# Altium project MB1829.PrjPcb (part 1 of 5)
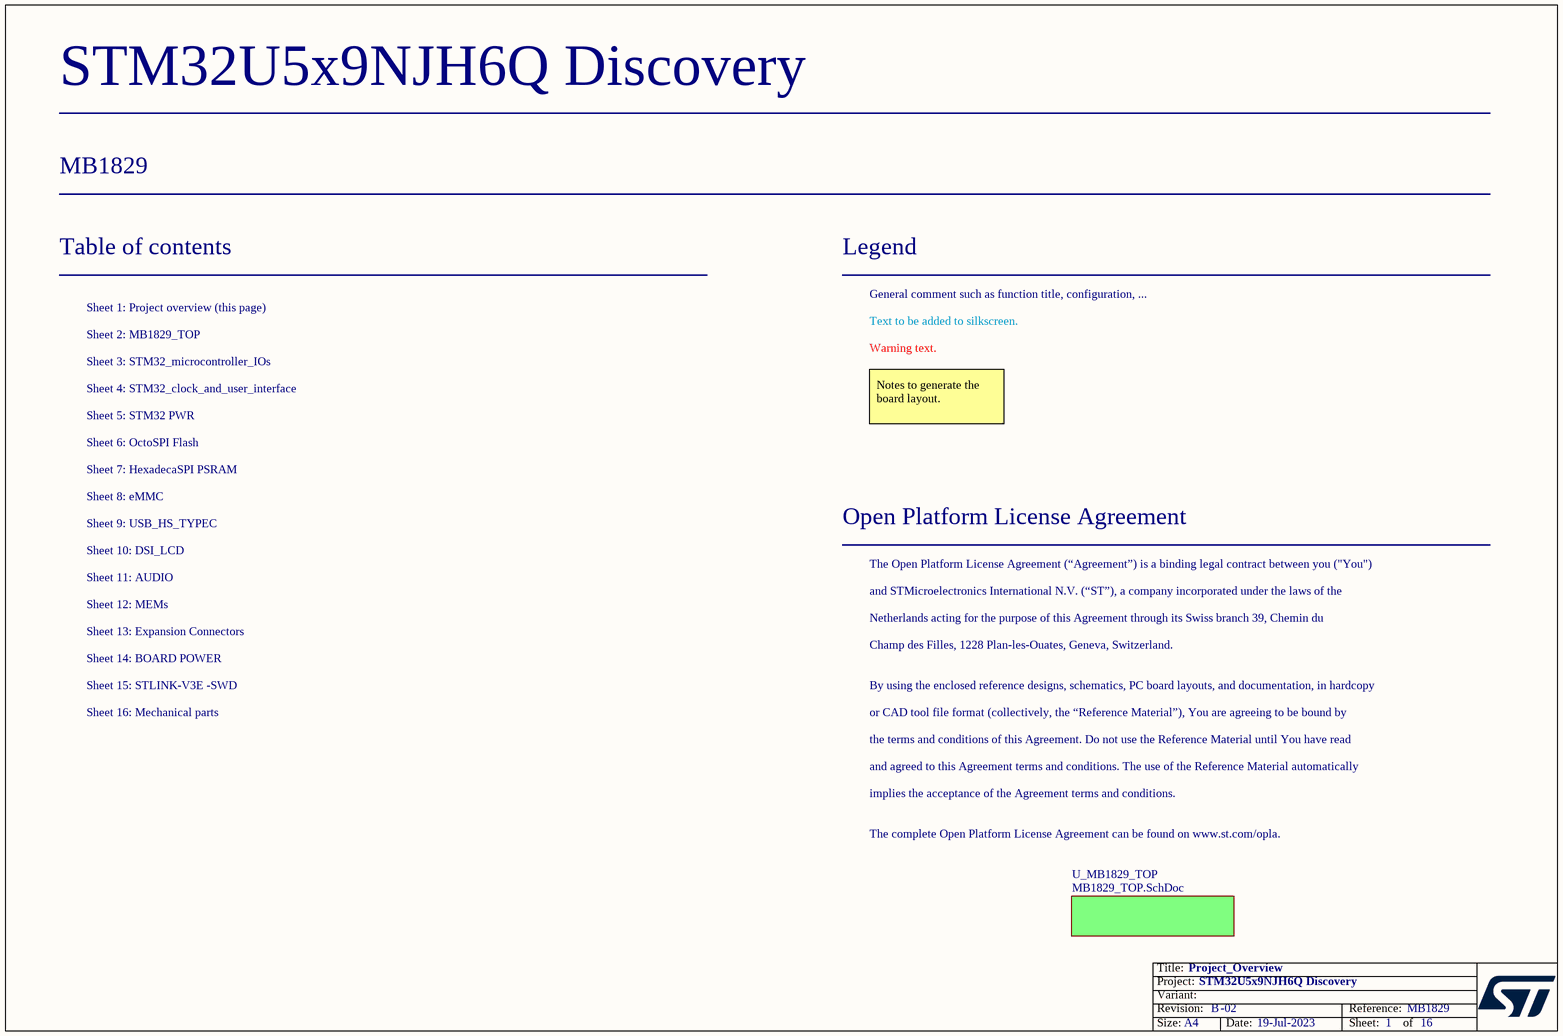
[diagram p0: Project_Overview.SchDoc]
Board_Assembly_Revision: 02; Board_Document_Date: 19-Jul-2023; Board_Name: STM32U5x9NJH6Q Discovery; Board_PCB_Revision: B; Board_Reference: MB1829
16 sheets, 473 parts. Net scope: flat (ports and power ports of the same name join across sheets).
Board file: MB1829.PcbDoc
Sheets:
  Project_Overview.SchDoc
    U_MB1829_TOP = MB1829_TOP.SchDoc
      U_EXPANSION_CONNECTORS = EXPANSION_CONNECTORS.SchDoc
      U_AUDIO = AUDIO.SchDoc
      U_BOARD_POWER = BOARD_POWER.SchDoc
      U_MCU_CLOCK_AND_USER_INTERFACE = MCU_CLOCK_AND_USER_INTERFACE.SchDoc
      U_MCU_IO = MCU_IO.SchDoc
      U_MCU_PWR = MCU_PWR.SchDoc
      U_MECHANICAL = MECHANICAL.SchDoc
      U_OCTOSPI_FLASH = OCTOSPI_FLASH.SchDoc
      U_ST_LINK_V3E = ST_LINK_V3E.SchDoc
      U_USBHS_TYPEC = USBHS_TYPEC.SchDoc
      U_eMMC = eMMC.SchDoc
      U_HEXADECASPI_PSRAM = HEXADECASPI_PSRAM.SchDoc
      U_DSI_LCD = DSI_LCD.SchDoc
      U_MEMS = MEMS.SchDoc

## Sheet Project_Overview.SchDoc: Project_Overview
size A4; Date: Not used; ApprovedBy: Not used; CheckedBy: Not used; Author: Not used; CompanyName: STMicroelectronics; DrawnBy: Not used; Engineer: Not used; Organization: Not used; Address1: Not used; Address2: Not used; Address3: Not used; Address4: Not used; DocumentNumber: Not used; Revision: Not used; SheetNumber: 1; SheetTotal: 16; CurrentTime: Not used; CurrentDate: Not used; Time: Not used; DocumentFullPathAndName: Not used; DocumentName: Not used; ModifiedDate: Not used; ImagePath: Not used; ProjectName: Not used; Application_BuildNumber: Not used

### Sub-sheets
U_MB1829_TOP = MB1829_TOP.SchDoc: no entries

### Notes on the sheet
- Table of contents
- Sheet 1: Project overview (this page)
- Legend
- General comment such as function title, configuration, ...
- Sheet 2: MB1829_TOP
- Sheet 3: STM32_microcontroller_IOs
- Text to be added to silkscreen.
- Warning text.
- Sheet 4: STM32_clock_and_user_interface
- Sheet 6: OctoSPI Flash
- Sheet 5: STM32 PWR
- Notes to generate the board layout.
- Sheet 8: eMMC
- Sheet 7: HexadecaSPI PSRAM
- Sheet 10: DSI_LCD
- Sheet 11: AUDIO
- Sheet 9: USB_HS_TYPEC
- Open Platform License Agreement
- The Open Platform License Agreement (“Agreement”) is a binding legal contract between you ("You")
- Sheet 13: Expansion Connectors
- Sheet 12: MEMs
- and STMicroelectronics International N.V. (“ST”), a company incorporated under the laws of the
- Netherlands acting for the purpose of this Agreement through its Swiss branch 39, Chemin du
- Champ des Filles, 1228 Plan-les-Ouates, Geneva, Switzerland.
- Sheet 15: STLINK-V3E -SWD
- Sheet 16: Mechanical parts
- Sheet 14: BOARD POWER
- By using the enclosed reference designs, schematics, PC board layouts, and documentation, in hardcopy
- or CAD tool file format (collectively, the “Reference Material”), You are agreeing to be bound by
- the terms and conditions of this Agreement. Do not use the Reference Material until You have read
- and agreed to this Agreement terms and conditions. The use of the Reference Material automatically
- implies the acceptance of the Agreement terms and conditions.
- The complete Open Platform License Agreement can be found on www.st.com/opla.
- Title:
- Project:
- Size:
- Revision:
- Variant:
- A4
- -
- Date:
- Reference:
- Sheet:
- of

## Sheet MB1829_TOP.SchDoc: MB1829 TOP
size A4; Date: Not used; ApprovedBy: Not used; CheckedBy: Not used; Author: Not used; CompanyName: STMicroelectronics; DrawnBy: Not used; Engineer: Not used; Organization: Not used; Address1: Not used; Address2: Not used; Address3: Not used; Address4: Not used; DocumentNumber: Not used; Revision: Not used; SheetNumber: 2; SheetTotal: 16; CurrentTime: Not used; CurrentDate: Not used; Time: Not used; DocumentFullPathAndName: Not used; DocumentName: Not used; ModifiedDate: Not used; ImagePath: Not used; ProjectName: Not used; Application_BuildNumber: Not used
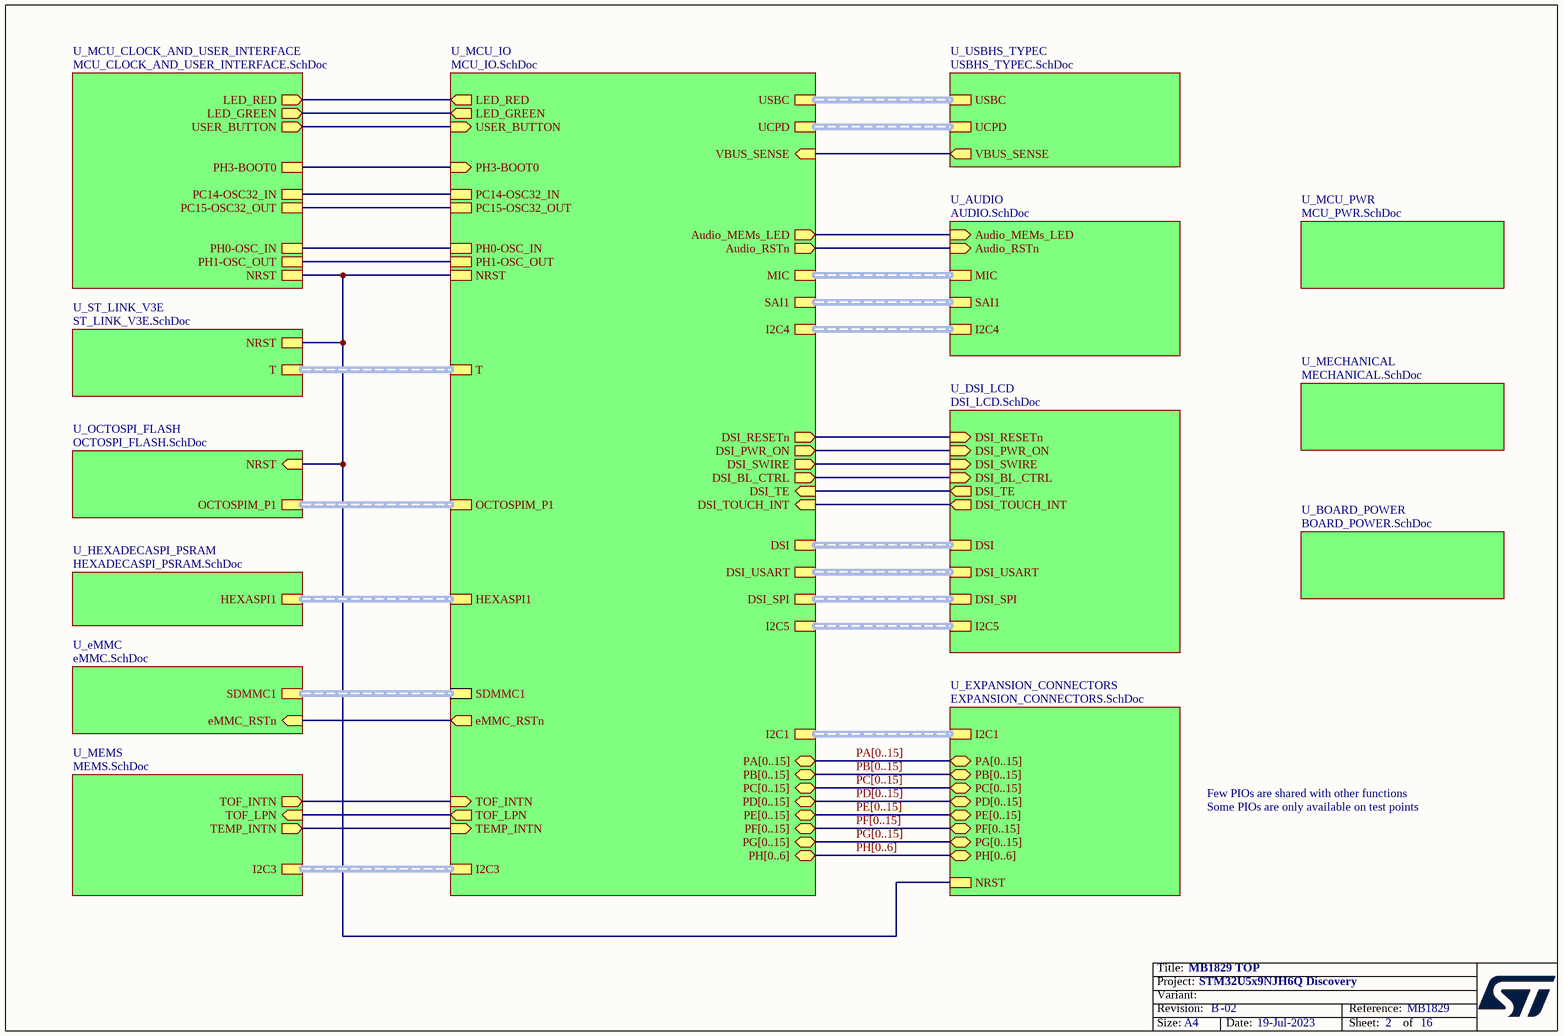
[diagram p1: MB1829_TOP.SchDoc]

### Sub-sheets
U_AUDIO = AUDIO.SchDoc: MIC (harness MIC), I2C4 (harness I2C4), SAI1 (harness SAI), Audio_RSTn (in), Audio_MEMs_LED (in)
U_BOARD_POWER = BOARD_POWER.SchDoc: no entries
U_DSI_LCD = DSI_LCD.SchDoc: DSI_RESETn (in), DSI_PWR_ON (in), DSI_SWIRE (in), DSI_BL_CTRL (in), DSI_TE (out), DSI_TOUCH_INT (out), DSI (harness DSI_LANES), I2C5 (harness I2C5), DSI_USART (harness DSI_USART), DSI_SPI (harness DSI_SPI)
U_eMMC = eMMC.SchDoc: eMMC_RSTn (in), SDMMC1 (harness eMMC)
U_EXPANSION_CONNECTORS = EXPANSION_CONNECTORS.SchDoc: NRST, I2C1 (harness I2C1), PC[0..15] (bidir), PA[0..15] (bidir), PB[0..15] (bidir), PD[0..15] (bidir), PE[0..15] (bidir), PH[0..6] (bidir), PF[0..15] (bidir), PG[0..15] (bidir)
U_HEXADECASPI_PSRAM = HEXADECASPI_PSRAM.SchDoc: HEXASPI1 (harness HEXASPI1)
U_MCU_CLOCK_AND_USER_INTERFACE = MCU_CLOCK_AND_USER_INTERFACE.SchDoc: NRST, PH3-BOOT0, PC14-OSC32_IN, PC15-OSC32_OUT, LED_RED (out), LED_GREEN (out), PH0-OSC_IN, PH1-OSC_OUT, USER_BUTTON (out)
U_MCU_IO = MCU_IO.SchDoc: PH3-BOOT0 (in), NRST, PH0-OSC_IN, PH1-OSC_OUT, PC14-OSC32_IN, PC15-OSC32_OUT, LED_RED (out), LED_GREEN (out), OCTOSPIM_P1 (harness OCTOSPI1), USBC (harness USBC), MIC (harness MIC), T (harness T), HEXASPI1 (harness HEXASPI1), SDMMC1 (harness eMMC), eMMC_RSTn (out), I2C4 (harness I2C4), SAI1 (harness SAI), USER_BUTTON (in), Audio_RSTn (out), I2C5 (harness I2C5), DSI_RESETn (out), DSI_PWR_ON (out), DSI_SWIRE (out), DSI_BL_CTRL (out), DSI_TE (in), DSI_TOUCH_INT (in), DSI_SPI (harness DSI_SPI), DSI_USART (harness DSI_USART), DSI (harness DSI_LANES), UCPD (harness UCPD_CTRL), VBUS_SENSE (in), PA[0..15] (bidir), PC[0..15] (bidir), PB[0..15] (bidir), PD[0..15] (bidir), PE[0..15] (bidir), PH[0..6] (bidir), PF[0..15] (bidir), PG[0..15] (bidir), I2C1 (harness I2C1), I2C3 (harness I2C3), TOF_INTN (in), TEMP_INTN (in), TOF_LPN (out), Audio_MEMs_LED (out)
U_MCU_PWR = MCU_PWR.SchDoc: no entries
U_MECHANICAL = MECHANICAL.SchDoc: no entries
U_MEMS = MEMS.SchDoc: I2C3 (harness I2C3), TOF_INTN (out), TOF_LPN (in), TEMP_INTN (out)
U_OCTOSPI_FLASH = OCTOSPI_FLASH.SchDoc: NRST (in), OCTOSPIM_P1 (harness OCTOSPI1)
U_ST_LINK_V3E = ST_LINK_V3E.SchDoc: NRST, T (harness T)
U_USBHS_TYPEC = USBHS_TYPEC.SchDoc: USBC (harness USBC), UCPD (harness UCPD_CTRL), VBUS_SENSE (out)

### Nets
(unnamed): sheet U_EXPANSION_CONNECTORS/NRST, sheet U_MCU_CLOCK_AND_USER_INTERFACE/NRST, sheet U_MCU_IO/NRST, sheet U_OCTOSPI_FLASH/NRST, sheet U_ST_LINK_V3E/NRST
(unnamed): sheet U_AUDIO/Audio_RSTn, sheet U_MCU_IO/Audio_RSTn
(unnamed): sheet U_AUDIO/Audio_MEMs_LED, sheet U_MCU_IO/Audio_MEMs_LED
(unnamed): sheet U_MCU_CLOCK_AND_USER_INTERFACE/PH3-BOOT0, sheet U_MCU_IO/PH3-BOOT0
(unnamed): sheet U_MCU_CLOCK_AND_USER_INTERFACE/PC14-OSC32_IN, sheet U_MCU_IO/PC14-OSC32_IN
(unnamed): sheet U_MCU_CLOCK_AND_USER_INTERFACE/PC15-OSC32_OUT, sheet U_MCU_IO/PC15-OSC32_OUT
(unnamed): sheet U_MCU_CLOCK_AND_USER_INTERFACE/LED_RED, sheet U_MCU_IO/LED_RED
(unnamed): sheet U_MCU_CLOCK_AND_USER_INTERFACE/LED_GREEN, sheet U_MCU_IO/LED_GREEN
(unnamed): sheet U_MCU_CLOCK_AND_USER_INTERFACE/PH0-OSC_IN, sheet U_MCU_IO/PH0-OSC_IN
(unnamed): sheet U_MCU_CLOCK_AND_USER_INTERFACE/PH1-OSC_OUT, sheet U_MCU_IO/PH1-OSC_OUT
(unnamed): sheet U_MCU_CLOCK_AND_USER_INTERFACE/USER_BUTTON, sheet U_MCU_IO/USER_BUTTON
(unnamed): sheet U_MCU_IO/eMMC_RSTn, sheet U_eMMC/eMMC_RSTn
(unnamed): sheet U_MCU_IO/DSI_RESETn, sheet U_DSI_LCD/DSI_RESETn
(unnamed): sheet U_MCU_IO/DSI_PWR_ON, sheet U_DSI_LCD/DSI_PWR_ON
(unnamed): sheet U_MCU_IO/DSI_SWIRE, sheet U_DSI_LCD/DSI_SWIRE
(unnamed): sheet U_MCU_IO/DSI_BL_CTRL, sheet U_DSI_LCD/DSI_BL_CTRL
(unnamed): sheet U_MCU_IO/DSI_TE, sheet U_DSI_LCD/DSI_TE
(unnamed): sheet U_MCU_IO/DSI_TOUCH_INT, sheet U_DSI_LCD/DSI_TOUCH_INT
(unnamed): sheet U_MCU_IO/VBUS_SENSE, sheet U_USBHS_TYPEC/VBUS_SENSE
(unnamed): sheet U_MCU_IO/TOF_INTN, sheet U_MEMS/TOF_INTN
(unnamed): sheet U_MCU_IO/TEMP_INTN, sheet U_MEMS/TEMP_INTN
(unnamed): sheet U_MCU_IO/TOF_LPN, sheet U_MEMS/TOF_LPN

### Buses and harness runs
bus PA[0..15] = sheet U_EXPANSION_CONNECTORS/PA[0..15] = sheet U_MCU_IO/PA[0..15]
bus PB[0..15] = sheet U_EXPANSION_CONNECTORS/PB[0..15] = sheet U_MCU_IO/PB[0..15]
bus PC[0..15] = sheet U_EXPANSION_CONNECTORS/PC[0..15] = sheet U_MCU_IO/PC[0..15]
bus PD[0..15] = sheet U_EXPANSION_CONNECTORS/PD[0..15] = sheet U_MCU_IO/PD[0..15]
bus PE[0..15] = sheet U_EXPANSION_CONNECTORS/PE[0..15] = sheet U_MCU_IO/PE[0..15]
bus PF[0..15] = sheet U_EXPANSION_CONNECTORS/PF[0..15] = sheet U_MCU_IO/PF[0..15]
bus PG[0..15] = sheet U_EXPANSION_CONNECTORS/PG[0..15] = sheet U_MCU_IO/PG[0..15]
bus PH[0..6] = sheet U_EXPANSION_CONNECTORS/PH[0..6] = sheet U_MCU_IO/PH[0..6]
harness sheet U_AUDIO/I2C4 = sheet U_MCU_IO/I2C4
harness sheet U_AUDIO/MIC = sheet U_MCU_IO/MIC
harness sheet U_AUDIO/SAI1 = sheet U_MCU_IO/SAI1
harness sheet U_DSI_LCD/DSI = sheet U_MCU_IO/DSI
harness sheet U_DSI_LCD/DSI_SPI = sheet U_MCU_IO/DSI_SPI
harness sheet U_DSI_LCD/DSI_USART = sheet U_MCU_IO/DSI_USART
harness sheet U_DSI_LCD/I2C5 = sheet U_MCU_IO/I2C5
harness sheet U_eMMC/SDMMC1 = sheet U_MCU_IO/SDMMC1
harness sheet U_EXPANSION_CONNECTORS/I2C1 = sheet U_MCU_IO/I2C1
harness sheet U_HEXADECASPI_PSRAM/HEXASPI1 = sheet U_MCU_IO/HEXASPI1
harness sheet U_MCU_IO/I2C3 = sheet U_MEMS/I2C3
harness sheet U_MCU_IO/OCTOSPIM_P1 = sheet U_OCTOSPI_FLASH/OCTOSPIM_P1
harness sheet U_MCU_IO/T = sheet U_ST_LINK_V3E/T
harness sheet U_MCU_IO/UCPD = sheet U_USBHS_TYPEC/UCPD
harness sheet U_MCU_IO/USBC = sheet U_USBHS_TYPEC/USBC

### Notes on the sheet
- Few PIOs are shared with other functions
- Some PIOs are only available on test points
- Title:
- Project:
- Size:
- Revision:
- Variant:
- A4
- -
- Date:
- Reference:
- Sheet:
- of

## Sheet EXPANSION_CONNECTORS.SchDoc: Expansion Connectors
size A3; Date: Not used; ApprovedBy: Not used; CheckedBy: Not used; Author: Not used; CompanyName: STMicroelectronics; DrawnBy: Not used; Engineer: Not used; Organization: Not used; Address1: Not used; Address2: Not used; Address3: Not used; Address4: Not used; DocumentNumber: Not used; Revision: Not used; SheetNumber: 13; SheetTotal: 16; CurrentTime: Not used; CurrentDate: Not used; Time: Not used; DocumentFullPathAndName: Not used; DocumentName: Not used; ModifiedDate: Not used; ImagePath: Not used; ProjectName: Not used; Application_BuildNumber: Not used
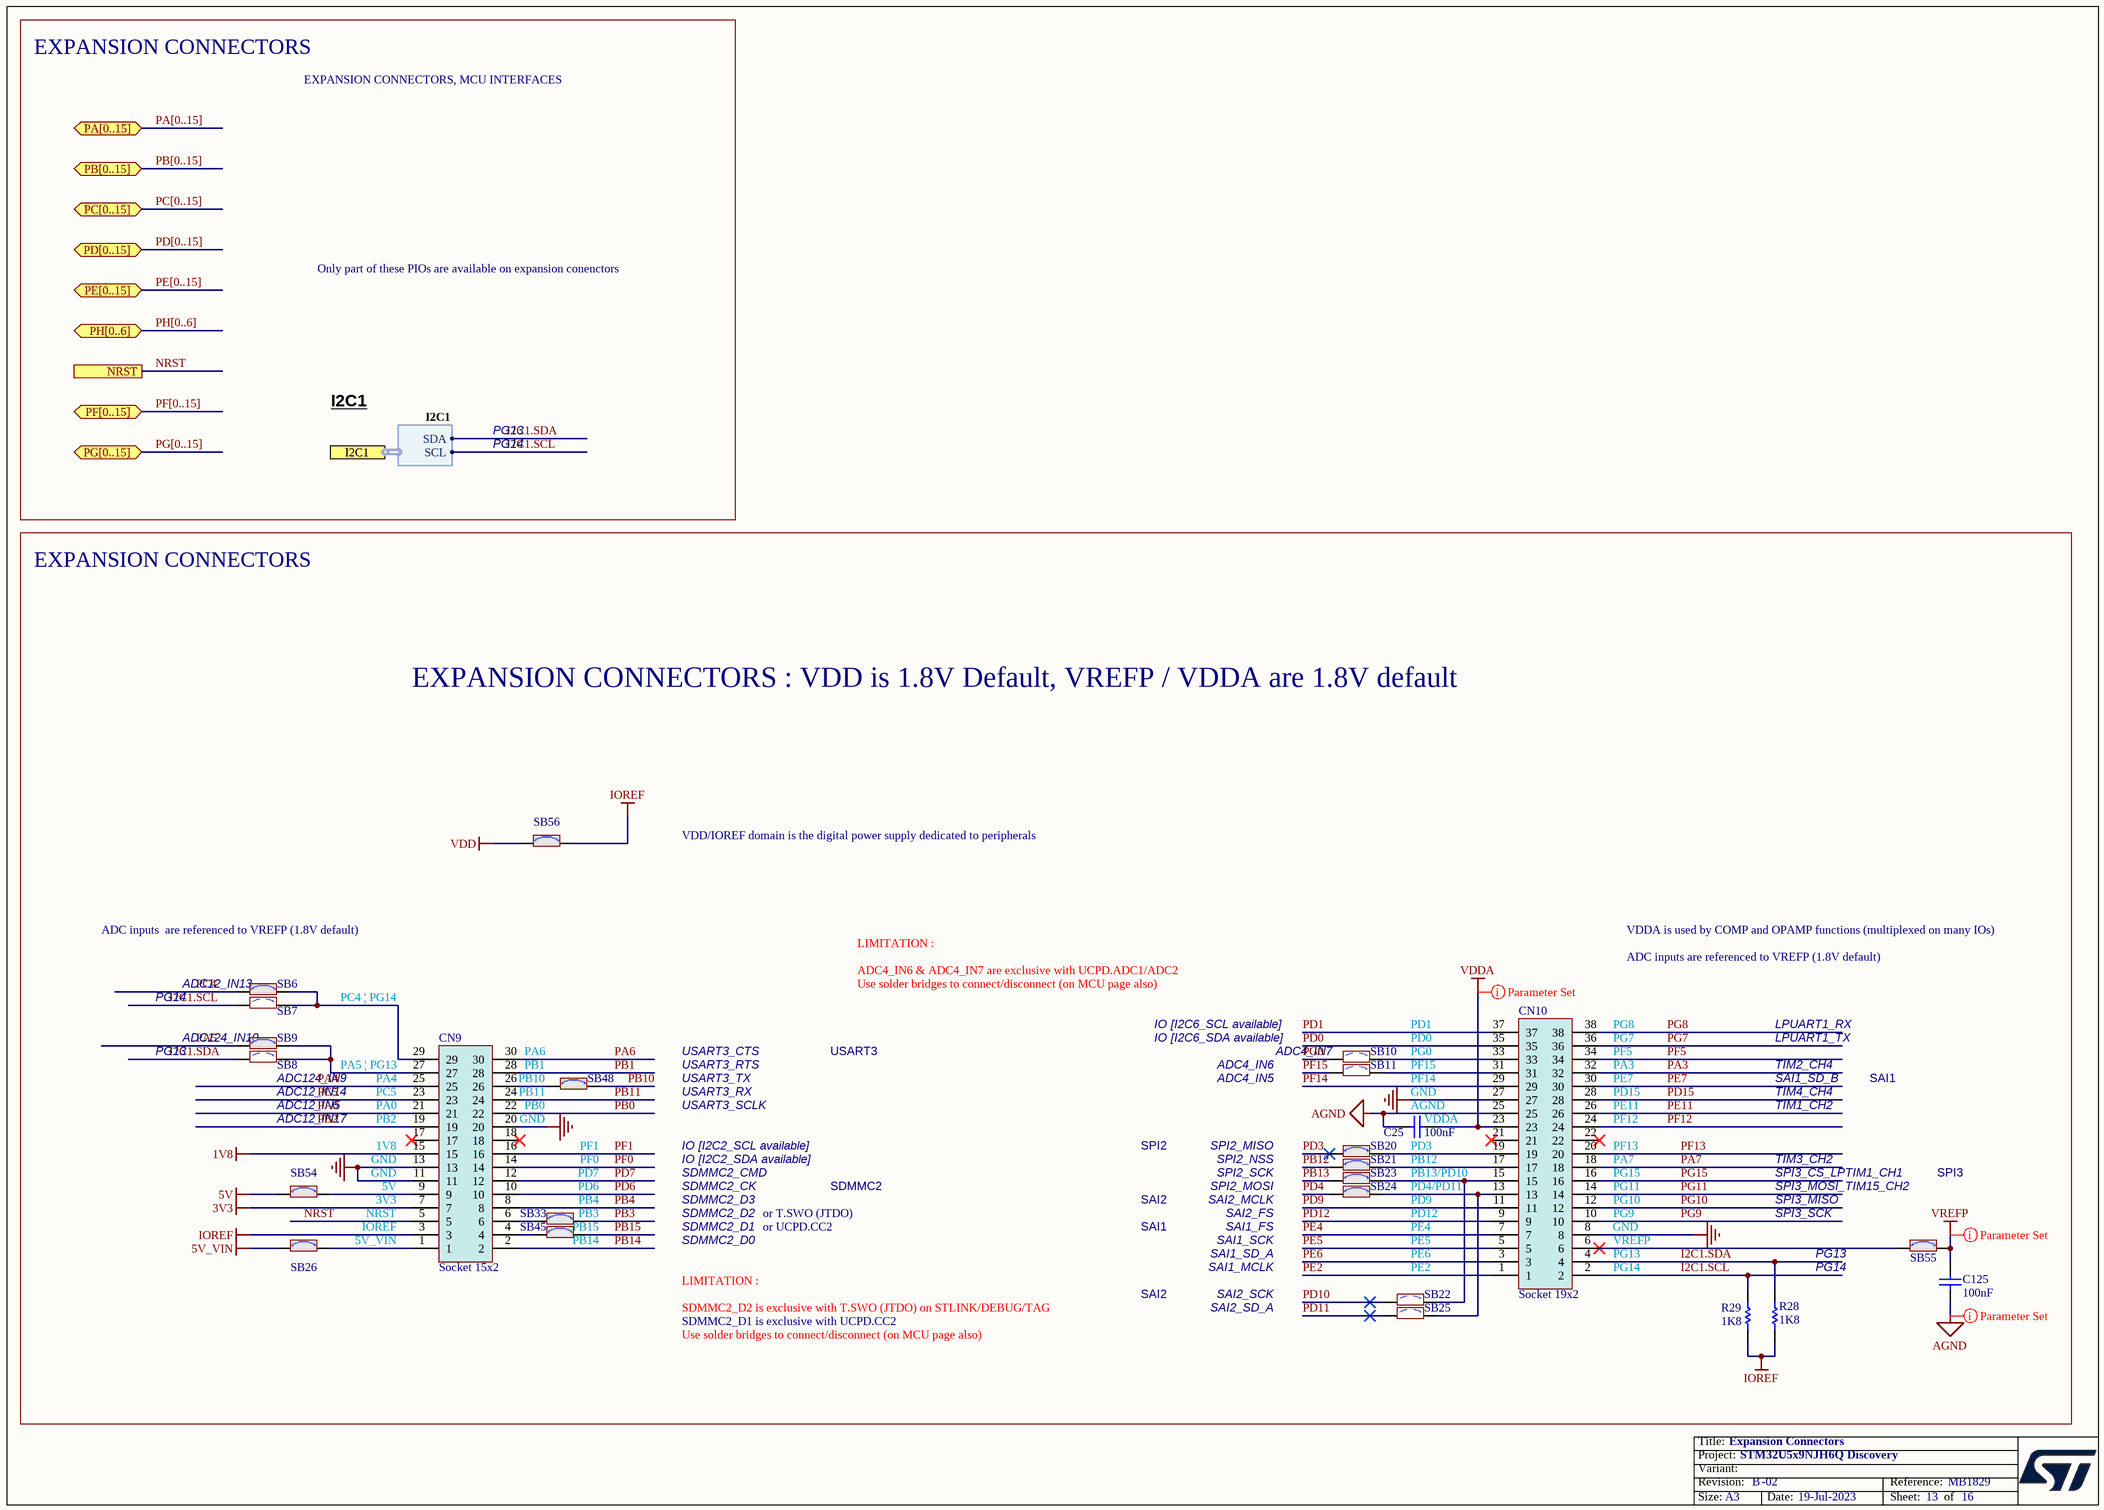
[diagram p2: EXPANSION_CONNECTORS.SchDoc]

### Parts
C25  value 100nF  [C0603]  (hidden comment: Capacitor)
C125  value 100nF  [C0603]  (hidden comment: Capacitor)
CN9  Socket 15x2  [CON_SAMTEC_SSW-115-21-F-D]
CN10  Socket 19x2  [CON_SAMTEC_SSW-119-21-F-D]
R28  value 1K8  [R0402]  (hidden comment: Resistor)
R29  value 1K8  [R0402]  (hidden comment: Resistor)
SB6  SB_ON  [SOLDER-BRIDGE_R0402-0R]  (value not drawn)
SB7  SB_OFF  [SOLDER-BRIDGE_R0402-0R]  (value not drawn)
SB8  SB_OFF  [SOLDER-BRIDGE_R0402-0R]  (value not drawn)
SB9  SB_ON  [SOLDER-BRIDGE_R0402-0R]  (value not drawn)
SB10  SB_OFF  [SOLDER-BRIDGE_R0402-0R]  (value not drawn)
SB11  SB_OFF  [SOLDER-BRIDGE_R0402-0R]  (value not drawn)
SB20  SB_ON  [SOLDER-BRIDGE_R0402-0R]  (value not drawn)
SB21  SB_ON  [SOLDER-BRIDGE_R0402-0R]  (value not drawn)
SB22  SB_OFF  [SOLDER-BRIDGE_R0402-0R]  (value not drawn)
SB23  SB_ON  [SOLDER-BRIDGE_R0402-0R]  (value not drawn)
SB24  SB_ON  [SOLDER-BRIDGE_R0402-0R]  (value not drawn)
SB25  SB_OFF  [SOLDER-BRIDGE_R0402-0R]  (value not drawn)
SB26  SB_ON  [SOLDER-BRIDGE_R0402-0R]  (value not drawn)
SB33  SB_ON  [SOLDER-BRIDGE_R0402-0R]  (value not drawn)
SB45  SB_ON  [SOLDER-BRIDGE_R0402-0R]  (value not drawn)
SB48  SB_ON  [SOLDER-BRIDGE_R0402-0R]  (value not drawn)
SB54  SB_ON  [SOLDER-BRIDGE_R0402-0R]  (value not drawn)
SB55  SB_ON  [SOLDER-BRIDGE_R0402-0R]  (value not drawn)
SB56  SB_ON  [SOLDER-BRIDGE_R0402-0R]  (value not drawn)

### Ports
I2C1 (harness I2C1), NRST, PA[0..15] (bidir), PB[0..15] (bidir), PC[0..15] (bidir), PD[0..15] (bidir), PE[0..15] (bidir), PF[0..15] (bidir), PG[0..15] (bidir), PH[0..6] (bidir)

### Harnesses
I2C1: SDA, SCL

### Nets
1V8: CN9.15
3V3: CN9.7
5V: SB54.1
5V_VIN: SB26.1
AGND: C25.1 C125.1 CN10.25
GND: CN9.11 CN9.13 CN9.20 CN10.8 CN10.27
IOREF: CN9.3 R28.2 R29.2 SB56.2
VDD: SB56.1
VDDA: C25.2 CN10.23
VREFP: C125.2 SB55.2
I2C1.SCL: CN10.2 R29.1 SB7.1 ; port I2C1.SCL
I2C1.SDA: CN10.4 R28.1 SB8.1 ; port I2C1.SDA
NRST: CN9.5 ; port NRST
PA0: CN9.21
PA3: CN10.32
PA4: CN9.25
PA5: SB9.1
PA6: CN9.30
PA7: CN10.18
PB0: CN9.22
PB1: CN9.28
PB2: CN9.19
PB3: SB33.2
PB4: CN9.8
PB10: SB48.2
PB11: CN9.24
PB12: SB21.1
PB13: SB23.1  [project net DSI_SPI_CLK]
PB14: CN9.2
PB15: SB45.2
PC4: SB6.1
PC5: CN9.23
PD0: CN10.35
PD1: CN10.37
PD3: SB20.1
PD4: SB24.1  [project net DSI_SPI_MOSI]
PD6: CN9.10
PD7: CN9.12
PD9: CN10.11
PD10: SB22.1
PD11: SB25.1  [project net DSI_SPI_D/CX]
PD12: CN10.9
PD15: CN10.28
PE2: CN10.1
PE4: CN10.7
PE5: CN10.5
PE6: CN10.3
PE7: CN10.30
PE11: CN10.26
PF0: CN9.14
PF1: CN9.16
PF5: CN10.34
PF12: CN10.24
PF13: CN10.20
PF14: CN10.29
PF15: SB11.1
PG0: SB10.1
PG7: CN10.36
PG8: CN10.38
PG9: CN10.10
PG10: CN10.12
PG11: CN10.14
PG15: CN10.16
NetCN9_1: CN9.1 SB26.2
NetCN9_4: CN9.4 SB45.1
NetCN9_6: CN9.6 SB33.1
NetCN9_9: CN9.9 SB54.2
NetCN9_26: CN9.26 SB48.1
NetCN9_27: CN9.27 SB8.2 SB9.2
NetCN9_29: CN9.29 SB6.2 SB7.2
NetCN10_6: CN10.6 SB55.1
NetCN10_13: CN10.13 SB24.2 SB25.2
NetCN10_15: CN10.15 SB22.2 SB23.2
NetCN10_17: CN10.17 SB21.2
NetCN10_19: CN10.19 SB20.2
NetCN10_31: CN10.31 SB11.2
NetCN10_33: CN10.33 SB10.2

Not connected (* = marked no-connect by the designer): CN9 17* 18*; CN10 21* 22*

### Buses and harness runs
bus PA[0..15] = port PA[0..15]
bus PB[0..15] = port PB[0..15]
bus PC[0..15] = port PC[0..15]
bus PD[0..15] = port PD[0..15]
bus PE[0..15] = port PE[0..15]
bus PF[0..15] = port PF[0..15]
bus PG[0..15] = port PG[0..15]
bus PH[0..6] = port PH[0..6]

### Layout directives
net class VREFP_AGND_VDD: AGND, VDDA, VREFP

### Notes on the sheet
- EXPANSION CONNECTORS
- EXPANSION CONNECTORS, MCU INTERFACES
- Only part of these PIOs are available on expansion conenctors
- I2C1
- PG13
- PG14
- EXPANSION CONNECTORS : VDD is 1.8V Default, VREFP / VDDA are 1.8V default
- VDD/IOREF domain is the digital power supply dedicated to peripherals
- ADC inputs  are referenced to VREFP (1.8V default)
- ADC12_IN13
- ADC4_IN6 & ADC4_IN7 are exclusive with UCPD.ADC1/ADC2
- Use solder bridges to connect/disconnect (on MCU page also)
- LIMITATION :
- ADC inputs are referenced to VREFP (1.8V default)
- VDDA is used by COMP and OPAMP functions (multiplexed on many IOs)
- ADC124_IN10
- PC4 | PG14
- PA6
- USART3_CTS
- USART3
- IO [I2C6_SDA available]
- IO [I2C6_SCL available]
- ADC4_IN7
- PG0
- PD0
- PD1
- (near CN10) PF5
- (near CN10) PG7
- (near CN10) PG8
- LPUART1_TX
- LPUART1_RX
- ADC12_IN17
- ADC12_IN5
- ADC12_IN14
- (near SB8) ADC124_IN9
- (near CN9) PB2
- (near CN9) PA0
- (near CN9) PC5
- (near CN9) PA4
- PA5 | PG13
- (near SB48) PB0
- (near SB48) PB11
- (near SB48) PB10
- (near SB48) PB1
- GND
- USART3_TX
- USART3_RX
- USART3_SCLK
- USART3_RTS
- ADC4_IN5
- ADC4_IN6
- PF14
- PF15
- (near C25) AGND
- (near C25) VDDA
- (near CN10) PF12
- (near CN10) PE11
- (near CN10) PD15
- (near CN10) PE7
- (near CN10) PA3
- TIM1_CH2
- TIM4_CH4
- TIM2_CH4
- SAI1_SD_B
- SAI1
- (near CN9) 5V
- (near CN9) GND
- (near CN9) 1V8
- PD6
- PD7
- PF0
- PF1
- SDMMC2_CK
- SDMMC2_CMD
- IO [I2C2_SDA available]
- IO [I2C2_SCL available]
- SDMMC2
- SPI2
- SPI2_MISO
- SPI2_NSS
- SPI2_MOSI
- SPI2_SCK
- PD4/PD11
- PB13/PD10
- PB12
- (near C25) PD3
- (near CN10) PF13
- (near CN10) PA7
- (near CN10) PG15
- (near CN10) PG11
- TIM3_CH2
- SPI3_CS_LPTIM1_CH1
- SPI3_MOSI_TIM15_CH2
- SPI3
- IOREF
- NRST
- 3V3
- 5V_VIN
- (near SB33) PB4
- PB3
- (near SB45) PB14
- PB15
- SDMMC2_D0
- SDMMC2_D1
- SDMMC2_D2
- SDMMC2_D3
- or T.SWO (JTDO)
- or UCPD.CC2
- SAI2
- SAI1_SD_A
- SAI1_SCK
- SAI1_FS
- SAI2_FS
- SAI2_MCLK
- PE6
- PE5
- PE4
- PD12
- PD9
- (near CN10) VREFP
- (near CN10) PG10
- (near CN10) PG9
- (near CN10) PG13
- (near CN10) GND
- SPI3_SCK
- SPI3_MISO
- SDMMC2_D2 is exclusive with T.SWO (JTDO) on STLINK/DEBUG/TAG
- SDMMC2_D1 is exclusive with UCPD.CC2
- SAI1_MCLK
- SAI2_SD_A
- SAI2_SCK
- PE2
- (near CN10) PG14
- Title:
- Project:
- Size:
- Revision:
- Variant:
- A3
- -
- Date:
- Reference:
- Sheet:
- of

### Library data of the parts
C25 C125 = MCD-00211: Capacitor, MLCC, 100nF, 16V, X7R, +/-10%, 0603, T=0.8mm; Manufacturer_Part_Number: CC0603KRX7R7BB104; Manufacturer: YAGEO; Part_Preference: Recommended; Order_Code_RS: 669-8763; Component_Country_Of_Origin: China; Internal_Part_Number: MCD-00211; Status: Released; Part_Type: Capacitor; Package: 0603; ComponentLink1URL: http://tunmcdsvn.tun.st.com/Component_Documentation_Library/Trunk/Capacitor/YAGEO_X7R_Series; Order_Code_Digikey: 311-1088-1-ND; Order_Code_Farnell: 432210
CN9 = MCD-02943: Socket, 15x2, 2.54mm, VR, TH, T=8.51mm/2.64mm; Part_Type: Connector; Part_Preference: Recommended; Manufacturer: SAMTEC; Manufacturer_Part_Number: SSW-115-21-F-D; Partial_Alternate_Internal_Part_Number: MCD-02945; ShowFields: YES; ID: 5059; Internal_Part_Number: MCD-02943; Value: Socket 15x2; Status: New; ComponentLink1URL: http://tunmcdsvn.tun.st.com/Component_Documentation_Library/Trunk/Connector/SAMTEC_SSW-SSQ(TH)_Series/; Order_Code_Digikey: SSW-115-21-F-D-ND; Order_Code_Farnell: N/A; Order_Code_RS: N/A
CN10 = MCD-02944: Socket, 19x2, 2.54mm, VR, TH, T=8.51mm/2.64mm; Part_Type: Connector; Part_Preference: Recommended; Manufacturer: SAMTEC; Manufacturer_Part_Number: SSW-119-21-F-D; Partial_Alternate_Internal_Part_Number: MCD-02946; ShowFields: YES; ID: 5060; Internal_Part_Number: MCD-02944; Value: Socket 19x2; Status: New; ComponentLink1URL: http://tunmcdsvn.tun.st.com/Component_Documentation_Library/Trunk/Connector/SAMTEC_SSW-SSQ(TH)_Series/; Order_Code_Digikey: SSW-119-21-F-D-ND; Order_Code_Farnell: N/A; Order_Code_RS: N/A
R28 R29 = MCD-00409: Resistor, 1K8, 0402, +/-1%, 1/16W; Manufacturer_Part_Number: RC0402FR-071K8L; Manufacturer: YAGEO; Part_Preference: Recommended; Component_Country_Of_Origin: China; Internal_Part_Number: MCD-00409; Status: Released; Part_Type: Resistor; Package: 0402; ComponentLink1URL: http://tunmcdsvn.tun.st.com/Component_Documentation_Library/Trunk/Resistor/YAGEO_RC_L_Series; Order_Code_Digikey: 311-1.80KLRCT-ND; Order_Code_Farnell: 9239260; Order_Code_RS: N/A
SB6 SB9 SB20 SB21 SB23 SB24 SB26 SB33 SB45 SB48 SB54-SB56 = MCD-01618: Solder Bridge 0402 ON; Part_Type: Misc; Manufacturer_Part_Number: RC0402JR-070RL; Manufacturer: YAGEO; Part_Preference: Recommended; Order_Code_RS: 618-5804; Component_Country_Of_Origin: China; Internal_Part_Number: MCD-01618; Status: Released; Package: SB0402; ComponentLink1URL: http://tunmcdsvn.tun.st.com/Component_Datasheet_Library/Trunk/Resistors/Yageo_Resistor_RC0402-series; Order_Code_Digikey: 311-0.0JRTR-ND; Order_Code_Farnell: 2363467
SB7 SB8 = MCD-02162: Solder Bridge 0402 OFF; Part_Type: Misc; Manufacturer_Part_Number: RC0402JR-070RL; Manufacturer: YAGEO; Part_Preference: Recommended; Order_Code_RS: 618-5804; Internal_Part_Number: MCD-02162; Status: Checked; Alternate_Manufacturer_Part_Number: N/A; Alternate_Manufacturer: N/A; Package: SB0402; ComponentLink1URL: http://tunmcdsvn.tun.st.com/Component_Datasheet_Library/Trunk/Resistors/Yageo_Resistor_RC0402-series; Order_Code_Digikey: 311-0.0JRTR-ND; Order_Code_Farnell: 2363467
SB10 SB11 SB22 SB25 = MCD-02162: Solder Bridge 0402 OFF; Part_Type: Misc; Manufacturer_Part_Number: RC0402JR-070RL; Manufacturer: YAGEO; Part_Preference: Recommended; Order_Code_RS: 618-5804; Component_Country_Of_Origin: China; Internal_Part_Number: MCD-02162; Status: Checked; Package: SB0402; ComponentLink1URL: http://tunmcdsvn.tun.st.com/Component_Datasheet_Library/Trunk/Resistors/Yageo_Resistor_RC0402-series; Order_Code_Digikey: 311-0.0JRTR-ND; Order_Code_Farnell: 2363467

## Sheet AUDIO.SchDoc: AUDIO
size A4; Date: Not used; ApprovedBy: Not used; CheckedBy: Not used; Author: Not used; CompanyName: STMicroelectronics; DrawnBy: Not used; Engineer: Not used; Organization: Not used; Address1: Not used; Address2: Not used; Address3: Not used; Address4: Not used; DocumentNumber: Not used; Revision: Not used; SheetNumber: 11; SheetTotal: 16; CurrentTime: Not used; CurrentDate: Not used; Time: Not used; DocumentFullPathAndName: Not used; DocumentName: Not used; ModifiedDate: Not used; ImagePath: Not used; ProjectName: Not used; Application_BuildNumber: Not used
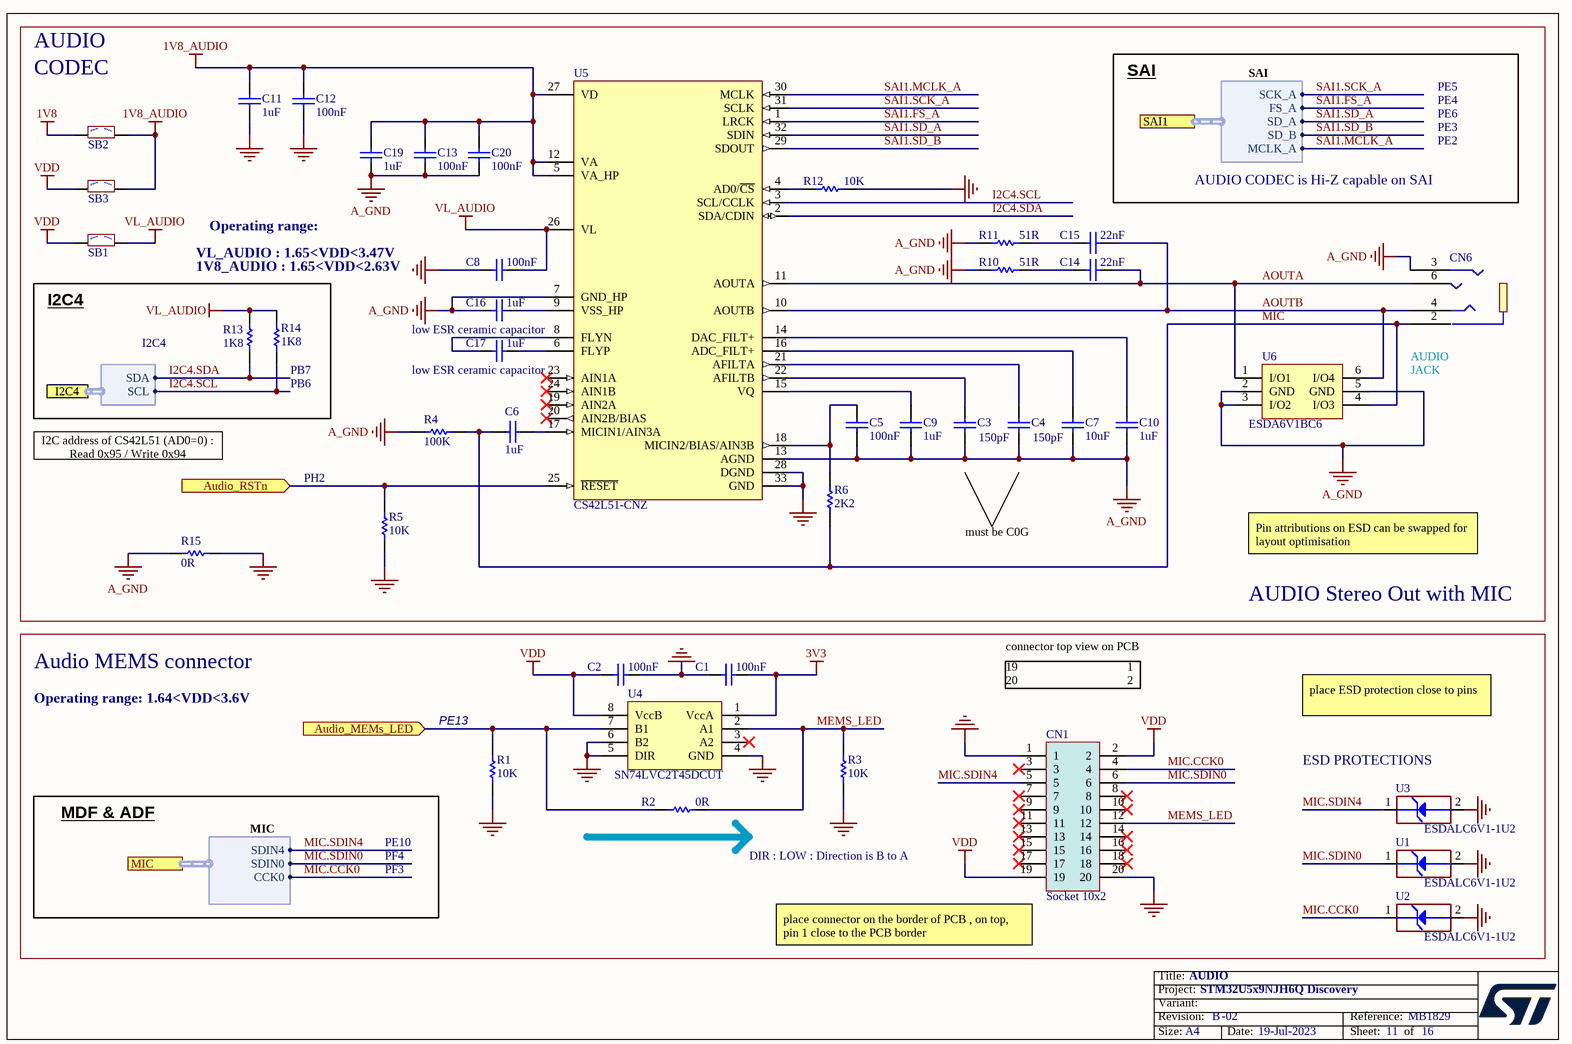
[diagram p3: AUDIO.SchDoc]

### Parts
C1  value 100nF  [C0402]  (hidden comment: Capacitor)
C2  value 100nF  [C0402]  (hidden comment: Capacitor)
C3  value 150pF  [C0603]  (hidden comment: Capacitor)
C4  value 150pF  [C0603]  (hidden comment: Capacitor)
C5  value 100nF  [C0402]  (hidden comment: Capacitor)
C6  value 1uF  [C0402]  (hidden comment: Capacitor)
C7  value 10uF  [C0603]  (hidden comment: Capacitor)
C8  value 100nF  [C0402]  (hidden comment: Capacitor)
C9  value 1uF  [C0402]  (hidden comment: Capacitor)
C10  value 1uF  [C0402]  (hidden comment: Capacitor)
C11  value 1uF  [C0402]  (hidden comment: Capacitor)
C12  value 100nF  [C0402]  (hidden comment: Capacitor)
C13  value 100nF  [C0402]  (hidden comment: Capacitor)
C14  value 22nF  [C0402]  (hidden comment: Capacitor)
C15  value 22nF  [C0402]  (hidden comment: Capacitor)
C16  value 1uF  [C0603]  (hidden comment: Capacitor)
C17  value 1uF  [C0603]  (hidden comment: Capacitor)
C19  value 1uF  [C0402]  (hidden comment: Capacitor)
C20  value 100nF  [C0402]  (hidden comment: Capacitor)
CN1  Socket 10x2  [CON_FCI_20021311-XXX20XXLF]
CN6  Jack_PJ3028B-3_4P  [CON_PHONE-JACK-3P5_HY_PJ3028B]  (value not drawn)
R1  value 10K  [R0402]  (hidden comment: Resistor)
R2  value 0R  [R0402]  (hidden comment: Resistor)
R3  value 10K  [R0402]  (hidden comment: Resistor)
R4  value 100K  [R0402]  (hidden comment: Resistor)
R5  value 10K  [R0402]  (hidden comment: Resistor)
R6  value 2K2  [R0402]  (hidden comment: Resistor)
R10  value 51R  [R0402]  (hidden comment: Resistor)
R11  value 51R  [R0402]  (hidden comment: Resistor)
R12  value 10K  [R0402]  (hidden comment: Resistor)
R13  value 1K8  [R0402]  (hidden comment: Resistor)
R14  value 1K8  [R0402]  (hidden comment: Resistor)
R15  value 0R  [R0402]  (hidden comment: Resistor)
SB1  SB_OFF  [SOLDER-BRIDGE_R0402-0R]  (value not drawn)
SB2  SB_OFF  [SOLDER-BRIDGE_R0402-0R]  (value not drawn)
SB3  SB_OFF  [SOLDER-BRIDGE_R0402-0R]  (value not drawn)
U1  value ESDALC6V1-1U2  [ESD_ST0201]  (hidden comment: ESD-TRANSIL)
U2  value ESDALC6V1-1U2  [ESD_ST0201]  (hidden comment: ESD-TRANSIL)
U3  value ESDALC6V1-1U2  [ESD_ST0201]  (hidden comment: ESD-TRANSIL)
U4  SN74LVC2T45DCUT  [ICC_VSSOP8_DCU_R-PDSO-G8_2X2P30_P050]
U5  CS42L51-CNZ  [ICC_QFN32-EPAD_5X5_P050]
U6  ESDA6V1BC6  [ESD_SOT23-6L]

### Blocks framed on the sheet
I2C4: R13 R14
Audio MEMS connector: C1 C2 CN1 R1-R3 U1-U4

### Ports
Audio_MEMs_LED (in), Audio_RSTn (in), I2C4 (harness I2C4), MIC (harness MIC), SAI1 (harness SAI)

### Harnesses
I2C4: SDA, SCL
MIC: SDIN0, CCK0, SDIN4
SAI: SD_B, FS_A, SD_A, SCK_A, MCLK_A

### Nets
1V8: SB2.1
1V8_AUDIO: C11.2 C12.2 C13.2 C19.2 C20.2 SB2.2 SB3.2 U5.5(VA_HP) U5.12(VA) U5.27(VD)
3V3: C1.2 U4.1(VccA)
A_GND: C3.1 C4.1 C5.1 C7.1 C9.1 C10.1 C13.1 C16.1 C19.1 C20.1 CN6.3 R4.1 R10.1 R11.1 R15.1 U5.7(GND_HP) U5.13(AGND) U6.2(GND) U6.3(I/O2) U6.5(GND)
GND: C1.1 C2.2 C8.2 C11.1 C12.1 CN1.1 CN1.20 R1.1 R3.1 R5.1 R12.2 R15.2 U1.2(GND) U2.2(GND) U3.2(GND) U4.4(GND) U4.5(DIR) U4.6(B2) U5.28(DGND) U5.33(GND)
VDD: C2.1 CN1.2 CN1.19 SB1.1 SB3.1 U4.8(VccB)
VL_AUDIO: C8.1 R13.2 R14.2 SB1.2 U5.26(VL)
AOUTA: C14.2 CN6.6 U5.11(AOUTA) U6.1(I/O1)
AOUTB: C15.2 CN6.4 U5.10(AOUTB) U6.6(I/O4)
AUDIO_MEMs_LED: R1.2 R2.1 U4.7(B1) ; port Audio_MEMs_LED
Audio_RSTn: R5.2 U5.25(~{RESET}) ; port Audio_RSTn
I2C4.SCL: R14.1 U5.3(SCL/CCLK) ; port I2C4.SCL
I2C4.SDA: R13.1 U5.2(SDA/CDIN) ; port I2C4.SDA
MEMS_LED: CN1.12 R2.2 R3.2 U4.2(A1)
MIC: C6.1 CN6.2 R4.2 R6.1 U6.4(I/O3)
MIC.CCK0: CN1.4 U2.1(IO1) ; port MIC.CCK0
MIC.SDIN0: CN1.6 U1.1(IO1) ; port MIC.SDIN0
MIC.SDIN4: CN1.5 U3.1(IO1) ; port MIC.SDIN4
SAI1.FS_A: U5.1(LRCK) ; port SAI1.FS_A  [project net PE4]
SAI1.MCLK_A: U5.30(MCLK) ; port SAI1.MCLK_A  [project net PE2]
SAI1.SCK_A: U5.31(SCLK) ; port SAI1.SCK_A  [project net PE5]
SAI1.SD_A: U5.32(SDIN) ; port SAI1.SD_A  [project net PE6]
SAI1.SD_B: U5.29(SDOUT) ; port SAI1.SD_B
NetC3_2: C3.2 U5.22(AFILTB)
NetC4_2: C4.2 U5.21(AFILTA)
NetC5_2: C5.2 R6.2 U5.18(MICIN2/BIAS/AIN3B)
NetC6_2: C6.2 U5.17(MICIN1/AIN3A)
NetC7_2: C7.2 U5.16(ADC_FILT+)
NetC9_2: C9.2 U5.15(VQ)
NetC10_2: C10.2 U5.14(DAC_FILT+)
NetC14_1: C14.1 R10.2
NetC15_1: C15.1 R11.2
NetC16_2: C16.2 U5.9(VSS_HP)
NetC17_1: C17.1 U5.8(FLYN)
NetC17_2: C17.2 U5.6(FLYP)
NetR12_1: R12.1 U5.4(AD0/~{CS})

Not connected (* = marked no-connect by the designer): CN1 3* 7* 8* 9* 10* 11* 13* 14* 15* 16* 17* 18*; U4 3(A2)*; U5 19(AIN2A)* 20(AIN2B/BIAS)* 23(AIN1A)* 24(AIN1B)*

### Notes on the sheet
- AUDIO
- CODEC
- SAI
- PE4
- PE5
- PE6
- AUDIO CODEC is Hi-Z capable on SAI
- PE2
- PE3
- Operating range:
- (near C8) VL_AUDIO : 1.65<VDD<3.47V
- 1V8_AUDIO : 1.65<VDD<2.63V
- PB6
- (near R14) PB7
- low ESR ceramic capacitor
- (near CN6) AUDIO
- JACK
- I2C address of CS42L51 (AD0=0) :
  Read 0x95 / Write 0x94
- PH2
- must be C0G
- Pin attributions on ESD can be swapped for layout optimisation
- connector top view on PCB
- AUDIO Stereo Out with MIC
- Operating range: 1.64<VDD<3.6V
- (near R1) PE13
- 19
- 20
- 1
- 2
- place ESD protection close to pins
- (near U3) ESD PROTECTIONS
- MDF & ADF
- PF4
- PE10
- (near R2) DIR : LOW : Direction is B to A
- PF3
- (near CN1) place connector on the border of PCB , on top, pin 1 close to the PCB border
- Title:
- Project:
- Size:
- Revision:
- Variant:
- A4
- -
- Date:
- Reference:
- Sheet:
- of

### Library data of the parts
C1 C2 C5 C8 C12 C13 C20 = MCD-00006: Capacitor, MLCC, 100nF, 16V, X7R, +/-10%, 0402, T=0.5mm; Manufacturer_Part_Number: CC0402KRX7R7BB104; Manufacturer: YAGEO; Part_Preference: Recommended; Order_Code_RS: 616-9701; Component_Country_Of_Origin: China; Internal_Part_Number: MCD-00006; Status: Released; Part_Type: Capacitor; Package: 0402; ComponentLink1URL: http://tunmcdsvn.tun.st.com/Component_Documentation_Library/Trunk/Capacitor/YAGEO_X7R_Series; Order_Code_Digikey: 311-1338-1-ND; Order_Code_Farnell: 9402047
C3 C4 = MCD-00304: Capacitor, MLCC, 150pF, 50V, COG, +/-5%, 0603, T=0.8mm; Manufacturer_Part_Number: CC0603JRNPO9BN151; Manufacturer: YAGEO; BMS_Part_Number: 9142051; Part_Preference: Recommended; Component_Country_Of_Origin: China; Internal_Part_Number: MCD-00304; Status: Released; Part_Type: Capacitor; Package: 0603; ComponentLink1URL: http://tunmcdsvn.tun.st.com/Component_Documentation_Library/Trunk/Capacitor/YAGEO_NP0_Series; Order_Code_Digikey: 311-1071-1-ND; Order_Code_Farnell: 722108; Order_Code_RS: N/A
C6 C9-C11 C19 = MCD-01722: Capacitor, MLCC, 1uF, 10V, X5R, +/-10%, 0402, T=0.5mm; Manufacturer_Part_Number: CC0402KRX5R6BB105; Manufacturer: YAGEO; Part_Preference: Recommended; Component_Country_Of_Origin: China; Internal_Part_Number: MCD-01722; Status: Released; Part_Type: Capacitor; Package: 0402; ComponentLink1URL: http://tunmcdsvn.tun.st.com/Component_Documentation_Library/Trunk/Capacitor/YAGEO_X5R_Series; Order_Code_Digikey: 311-1439-1-ND; Order_Code_Farnell: 1458896; Order_Code_RS: N/A
C7 = MCD-00243: Capacitor, MLCC, 10uF, 6V3, X5R, +/-10%, 0603, T=0.8mm; Manufacturer_Part_Number: CC0603KRX5R5BB106; Manufacturer: YAGEO; Part_Preference: Recommended; Component_Country_Of_Origin: China; Internal_Part_Number: MCD-00243; Status: Released; Part_Type: Capacitor; Package: 0603; ComponentLink1URL: http://tunmcdsvn.tun.st.com/Component_Documentation_Library/Trunk/Capacitor/YAGEO_X5R_Series; Order_Code_Digikey: 311-1781-1-ND; Order_Code_Farnell: N/A; Order_Code_RS: N/A
C14 C15 = MCD-00202: Capacitor, MLCC, 22nF, 16V, X7R, +/-10%, 0402, T=0.5mm; Manufacturer_Part_Number: CC0402KRX7R7BB223; Manufacturer: YAGEO; Part_Preference: Recommended; Component_Country_Of_Origin: China; Internal_Part_Number: MCD-00202; Status: Released; Part_Type: Capacitor; Package: 0402; ComponentLink1URL: http://tunmcdsvn.tun.st.com/Component_Documentation_Library/Trunk/Capacitor/YAGEO_X7R_Series; Order_Code_Digikey: 311-1378-1-ND; Order_Code_Farnell: 3019299; Order_Code_RS: N/A
C16 C17 = MCD-00010: Capacitor, MLCC, 1uF, 16V, X5R, +/-10%, 0603, T=0.8mm; Manufacturer_Part_Number: CC0603KRX5R7BB105; Manufacturer: YAGEO; Part_Preference: Recommended; Component_Country_Of_Origin: China; Internal_Part_Number: MCD-00010; Status: Released; Part_Type: Capacitor; Package: 0603; ComponentLink1URL: http://tunmcdsvn.tun.st.com/Component_Documentation_Library/Trunk/Capacitor/YAGEO_X5R_Series; Order_Code_Digikey: 311-1444-1-ND; Order_Code_Farnell: 2370680; Order_Code_RS: N/A
CN1 = MCD-00147: Socket, 10x2, 1.27mm, VR, TH, T=4.30mm/2.40mm; Part_Type: Connector; Part_Preference: Recommended; Manufacturer: AMPHENOL ICC; Manufacturer_Part_Number: 20021311-00020T4LF; Order_Code_RS: 170-8859; Component_Country_Of_Origin: China; Internal_Part_Number: MCD-00147; Value: Socket 10x2; Status: Released; ComponentLink1URL: http://tunmcdsvn.tun.st.com/Component_Documentation_Library/Trunk/Connector/AMPHENOL_ICC_20021311_Series/; Order_Code_Digikey: 609-3759-ND; Order_Code_Farnell: 1865317
CN6 = MCD-00263: Jack_ Socket-Stereo, 3.5mm, 4 pins, RA, SMD, T=5mm; Part_Type: Connector; Manufacturer: QIAOD; Part_Preference: Recommended; Value: Jack_ Socket-Stereo_PJ3028B-3_4P; Component_Country_Of_Origin: Unknown; Internal_Part_Number: MCD-00263; Status: Released; Manufacturer_Part_Number: PJ3028B-3_4P; ComponentLink1URL: http://tunmcdsvn.tun.st.com/Component_Documentation_Library/Trunk/Connector/QIAOD_PJ3028B-3_4P/; Order_Code_Digikey: N/A; Order_Code_Farnell: N/A; Order_Code_RS: N/A
R1 R3 R5 R12 = MCD-00053: Resistor, 10K, 0402, +/-1%, 1/16W; Manufacturer_Part_Number: RC0402FR-0710KL; Manufacturer: YAGEO; BMS_Part_Number: 9131590; Part_Preference: Recommended; Component_Country_Of_Origin: China; Internal_Part_Number: MCD-00053; Status: Released; Part_Type: Resistor; ComponentLink1URL: http://tunmcdsvn.tun.st.com/Component_Documentation_Library/Trunk/Resistor/YAGEO_RC_L_Series; Package: 0402; Order_Code_Digikey: 311-10.0KLRCT-ND; Order_Code_Farnell: 9239359; Order_Code_RS: N/A
R2 R15 = MCD-00052: Resistor, 0R, 0402, +/-5%, 1/16W; Manufacturer_Part_Number: RC0402JR-070RL; Manufacturer: YAGEO; Part_Preference: Recommended; Order_Code_RS: 618-5804; Component_Country_Of_Origin: China; Internal_Part_Number: MCD-00052; Status: Released; Part_Type: Resistor; Package: 0402; ComponentLink1URL: http://tunmcdsvn.tun.st.com/Component_Documentation_Library/Trunk/Resistor/YAGEO_RC_L_Series; Order_Code_Digikey: 311-0.0JRCT-ND; Order_Code_Farnell: 9232516RL
R4 = MCD-00059: Resistor, 100K, 0402, +/-1%, 1/16W; Manufacturer_Part_Number: RC0402FR-07100KL; Manufacturer: YAGEO; Part_Preference: Recommended; Component_Country_Of_Origin: China; ShowFields: YES; ID: 2533; Internal_Part_Number: MCD-00059; Status: Released; Part_Type: Resistor; ComponentLink1URL: http://tunmcdsvn.tun.st.com/Component_Documentation_Library/Trunk/Resistor/YAGEO_RC_L_Series; Package: 0402; Order_Code_Digikey: 311-100KLRTR-ND; Order_Code_Farnell: 2421891; Order_Code_RS: N/A
R6 = MCD-00057: Resistor, 2K2, 0402, +/-1%, 1/16W; Manufacturer_Part_Number: RC0402FR-072K2L; Manufacturer: YAGEO; Part_Preference: Recommended; Component_Country_Of_Origin: China; Internal_Part_Number: MCD-00057; Status: Released; Part_Type: Resistor; ComponentLink1URL: http://tunmcdsvn.tun.st.com/Component_Documentation_Library/Trunk/Resistor/YAGEO_RC_L_Series; Package: 0402; Order_Code_Digikey: 311-2.20KLRCT-ND; Order_Code_Farnell: 9239278; Order_Code_RS: N/A
R10 R11 = MCD-00485: Resistor, 51R, 0402, +/-1%, 1/16W; Manufacturer_Part_Number: RC0402FR-0751RL; Manufacturer: YAGEO; Part_Preference: Recommended; Component_Country_Of_Origin: China; Internal_Part_Number: MCD-00485; Status: Released; Part_Type: Resistor; ComponentLink1URL: http://tunmcdsvn.tun.st.com/Component_Documentation_Library/Trunk/Resistor/YAGEO_RC_L_Series; Package: 0402; Order_Code_Digikey: 311-51.0LRCT-ND; Order_Code_Farnell: 1458803; Order_Code_RS: N/A
R13 R14 = MCD-00409: as R28 on sheet EXPANSION_CONNECTORS; Internal_Part_Number: MCD-00409; Status: Released; Part_Type: Resistor; Package: 0402; ComponentLink1URL: http://tunmcdsvn.tun.st.com/Component_Documentation_Library/Trunk/Resistor/YAGEO_RC_L_Series; Order_Code_Digikey: 311-1.80KLRCT-ND; Order_Code_Farnell: 9239260; Order_Code_RS: N/A
SB1 SB2 = MCD-02162: Solder Bridge 0402 OFF; Part_Type: Misc; Manufacturer_Part_Number: RC0402JR-070RL; Manufacturer: YAGEO; Part_Preference: Recommended; Order_Code_RS: 618-5804; Component_Country_Of_Origin: China; ShowFields: YES; ID: 4262; Internal_Part_Number: MCD-02162; Status: Released; Package: SB0402; ComponentLink1URL: http://tunmcdsvn.tun.st.com/Component_Datasheet_Library/Trunk/Resistors/Yageo_Resistor_RC0402-series; Order_Code_Digikey: 311-0.0JRTR-ND; Order_Code_Farnell: 2363467
SB3 = MCD-02162: as SB10 on sheet EXPANSION_CONNECTORS; Internal_Part_Number: MCD-02162; Status: Checked; Package: SB0402; ComponentLink1URL: http://tunmcdsvn.tun.st.com/Component_Datasheet_Library/Trunk/Resistors/Yageo_Resistor_RC0402-series; Order_Code_Digikey: 311-0.0JRTR-ND; Order_Code_Farnell: 2363467
U1-U3 = MCD-00170: ESD protection 6V1; Part_Type: Diode; Manufacturer: STMICROELECTRONICS; BMS_Part_Number: 9151132; Part_Preference: Recommended; Manufacturer_HQ_COO: EU; Component_Country_Of_Origin: China; Internal_Part_Number: MCD-00170; Status: Released; Manufacturer_Part_Number: ESDALC6V1-1U2; ComponentLink1URL: http://tunmcdsvn.tun.st.com/Component_Datasheet_Library/Trunk/Diodes/STM_ESD_ESDALC6V1-1U2
U4 = MCD-00264: Dual bit dual supply bus transceiver; Part_Type: IC; Manufacturer: TEXAS INSTRUMENTS; BMS_Part_Number: 9169311; Part_Preference: Recommended; Component_Country_Of_Origin: Thailand; Internal_Part_Number: MCD-00264; Value: SN74LVC2T45DCUT; Status: Released; Manufacturer_Part_Number: SN74LVC2T45DCUT; ComponentLink1URL: http://tunmcdsvn.tun.st.com/Component_Datasheet_Library/Trunk/IC/TI_Dual_bit_tranceiver_SN74LVC2T45
U5 = MCD-00265: Low-Power, Stereo Codec with Headphone Amp; Manufacturer: CIRRUS LOGIC; Part_Type: IC; Part_Preference: Recommended; Component_Country_Of_Origin: China; Internal_Part_Number: MCD-00265; Value: CS42L51-CNZ; Manufacturer_Part_Number: CS42L51-CNZ; ComponentLink1URL: http://tunmcdsvn.tun.st.com/Component_Datasheet_Library/Trunk/IC/Cirrus Logic_CS42L51; Status: Released
U6 = MCD-00247: Quad Bidir ESD protection; Manufacturer: STMICROELECTRONICS; Part_Type: Diode; BMS_Part_Number: 9179038; Part_Preference: Recommended; Manufacturer_HQ_COO: EU; Component_Country_Of_Origin: China; Value: ESDA6V1BC6; Internal_Part_Number: MCD-00247; Manufacturer_Part_Number: ESDA6V1BC6; Status: Released; ComponentLink1URL: http://tunmcdsvn.tun.st.com/Component_Datasheet_Library/Trunk/Diodes/STM_ESD_ESDA6V1BC6